# EAGLE design OpenHPI Embedded Smart Home RPi Board2 (EAGLE 7.5.0)
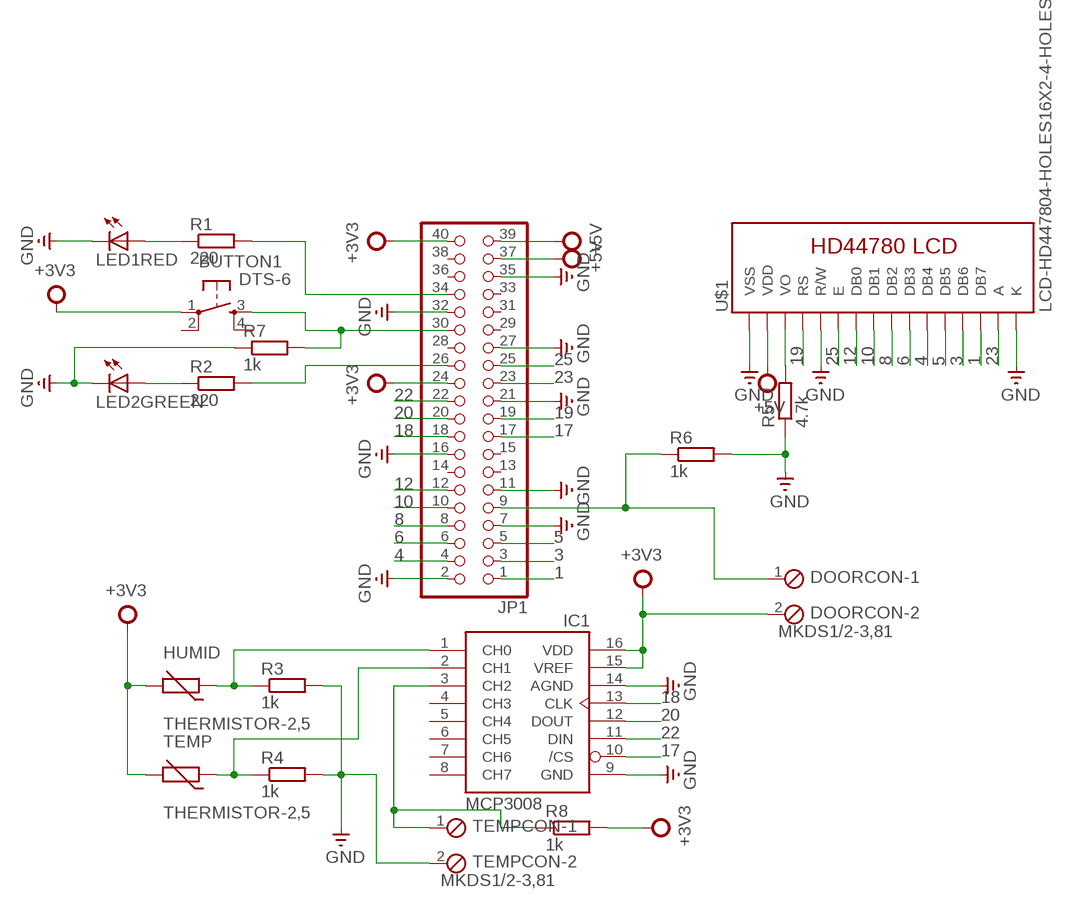
[diagram p0: schematic, sheet 1]

## Parts
BUTTON1  DTS-6  [DTS-6]
DOORCON  MKDS1/2-3,81  [2POL381]
HUMID  THERMISTOR-2,5  [RS-2,5]
IC1  MCP3008  [DIL16]
JP1  PINHD-2X20  [2X20]
LED1RED  LED5MM  [LED5MM]
LED2GREEN  LED5MM  [LED5MM]
R1  220  R-EU_0207/7  [0207/7]
R2  220  R-EU_0207/7  [0207/7]
R3  1k  R-EU_0207/7  [0207/7]
R4  1k  R-EU_0207/7  [0207/7]
R5  4.7k  R-EU_0207/7  [0207/7]
R6  1k  R-EU_0207/7  [0207/7]
R7  1k  R-EU_0207/7  [0207/7]
R8  1k  R-EU_0207/7  [0207/7]
TEMP  THERMISTOR-2,5  [RS-2,5]
TEMPCON  MKDS1/2-3,81  [2POL381]
U$1  LCD-HD447804-HOLES16X2-4-HOLES  [LCD-16X2-4HOLES]

## Nets
1: JP1.1 U$1.14(DB7)
3: JP1.3 U$1.13(DB6)
4: JP1.4 U$1.11(DB4)
5: JP1.5 U$1.12(DB5)
6: JP1.6 U$1.10(DB3)
8: JP1.8 U$1.9(DB2)
10: JP1.10 U$1.8(DB1)
12: JP1.12 U$1.7(DB0)
17: IC1.10(/CS) JP1.17
18: IC1.13(CLK) JP1.18
19: JP1.19 U$1.4(RS)
20: IC1.12(DOUT) JP1.20
22: IC1.11(DIN) JP1.22
23 [pwr]: JP1.23 U$1.15(A)
25: JP1.25 U$1.6(E)
+3V3 [pwr]: BUTTON1.1 DOORCON.2 HUMID.2 IC1.15(VREF) IC1.16(VDD) JP1.24 JP1.40 R8.2 TEMP.2
+5V [pwr]: JP1.37 JP1.39 U$1.2(VDD)
GND [pwr]: IC1.9(GND) IC1.14(AGND) JP1.2 JP1.7 JP1.11 JP1.16 JP1.21 JP1.27 JP1.32 JP1.35 LED1RED.K(C) LED2GREEN.K(C) R3.2 R4.2 R5.1 R6.2 R7.1 TEMPCON.2 U$1.1(VSS) U$1.5(R/W) U$1.16(K)
N$1: LED1RED.A R1.1
N$2: LED2GREEN.A R2.1
N$3: R5.2 U$1.3(VO)
N$4: BUTTON1.3 JP1.30 R7.2
N$5: JP1.34 R1.2
N$6: JP1.26 R2.2
N$9: HUMID.1 IC1.1(CH0) R3.1
N$10: IC1.2(CH1) R4.1 TEMP.1
N$11: IC1.3(CH2) R8.1 TEMPCON.1
N$17: DOORCON.1 JP1.9 R6.1
Unconnected: BUTTON1.2 BUTTON1.4 IC1.4(CH3) IC1.5(CH4) IC1.6(CH5) IC1.7(CH6) IC1.8(CH7) JP1.13 JP1.14 JP1.15 JP1.28 JP1.29 JP1.31 JP1.33 JP1.36 JP1.38

## Library data of the parts
BUTTON1 = switch-tact:DTS-6
DOORCON TEMPCON = con-phoenix-381:MKDS1/2-3,81: MKDS 1/2-3,81 - Order No. 1727010 (RS-Online - 101-5384) Pitch: 3,81mm Number of terminals: 2 Rated Voltage: 160V Maximum load current/ cross section: 12A/1.5mm2-AWG16 Housing Interlocking: none Color: Green
HUMID TEMP = varistor:THERMISTOR: THERMISTOR
IC1 = adafruit:MCP3008
JP1 = pinhead:PINHD-2X20: PIN HEADER
LED1RED LED2GREEN = led:LED: LED OSRAM: - CHIPLED LG R971, LG N971, LY N971, LG Q971, LY Q971, LO R971, LY R971 LH N974, LH R974 LS Q976, LO Q976, LY Q976 LO Q996 - Hyper CHIPLED LW Q18S LB Q993, LB Q99A, LB R99A - SideLED LS A670, LO A670, LY A670, LG A670, LP A670 LB A673, LV A673, LT A673, LW A673 LH A674 LY A675 LS A676, LA A676, LO A676, LY A676, LW A676 LS A679, LY A679, LG A679 - Hyper Micro SIDELED® LS Y876, LA Y876, LO Y876, LY Y876 LT Y87S - SmartLED LW L88C, LW L88S LB L89C, LB L89S, LG L890 LS L89K, LO L89K, LY L89K LS L896, LA L896, LO L896, LY L896 - TOPLED LS T670, LO T670, LY T670, LG T670, LP T670 LSG T670, LSP T670, LSY T670, LOP T670, LYG T670 LG T671, LOG T671, LSG T671 LB T673, LV T673, LT T673, LW T673 LH T674 LS T676, LA T676, LO T676, LY T676, LB T676, LH T676, LSB T676, LW T676 LB T67C, LV T67C, LT T67C, LS T67K, LO T67K, LY T67K, LW E67C LS E67B, LA E67B, LO E67B, LY E67B, LB E67C, LV E67C, LT E67C LW T67C LS T679, LY T679, LG T679 LS T770, LO T770, LY T770, LG T770, LP T770 LB T773, LV T773, LT T773, LW T773 LH T774 LS E675, LA E675, LY E675, LS T675 LS T776, LA T776, LO T776, LY T776, LB T776 LHGB T686 LT T68C, LB T68C - Hyper Mini TOPLED® LB M676 - Mini TOPLED Santana® LG M470 LS M47K, LO M47K, LY M47K Source: http://www.osram.convergy.de LUXEON: - LUMILED® LXK2-PW12-R00, LXK2-PW12-S00, LXK2-PW14-U00, LXK2-PW14-V00 LXK2-PM12-R00, LXK2-PM12-S00, LXK2-PM14-U00 LXK2-PE12-Q00, LXK2-PE12-R00, LXK2-PE12-S00, LXK2-PE14-T00, LXK2-PE14-U00 LXK2-PB12-K00, LXK2-PB12-L00, LXK2-PB12-M00, LXK2-PB14-N00, LXK2-PB14-P00, LXK2-PB14-Q00 LXK2-PR12-L00, LXK2-PR12-M00, LXK2-PR14-Q00, LXK2-PR14-R00 LXK2-PD12-Q00, LXK2-PD12-R00, LXK2-PD12-S00 LXK2-PH12-R00, LXK2-PH12-S00 LXK2-PL12-P00, LXK2-PL12-Q00, LXK2-PL12-R00 Source: www.luxeon.com KINGBRIGHT: KA-3528ASYC Source: www.kingbright.com
R1-R8 = rcl:R-EU_: RESISTOR, European symbol
U$1 = HD44780LCD:LCD-HD44780

## Net classes
1 pwr: width 0.33 mm

## Board
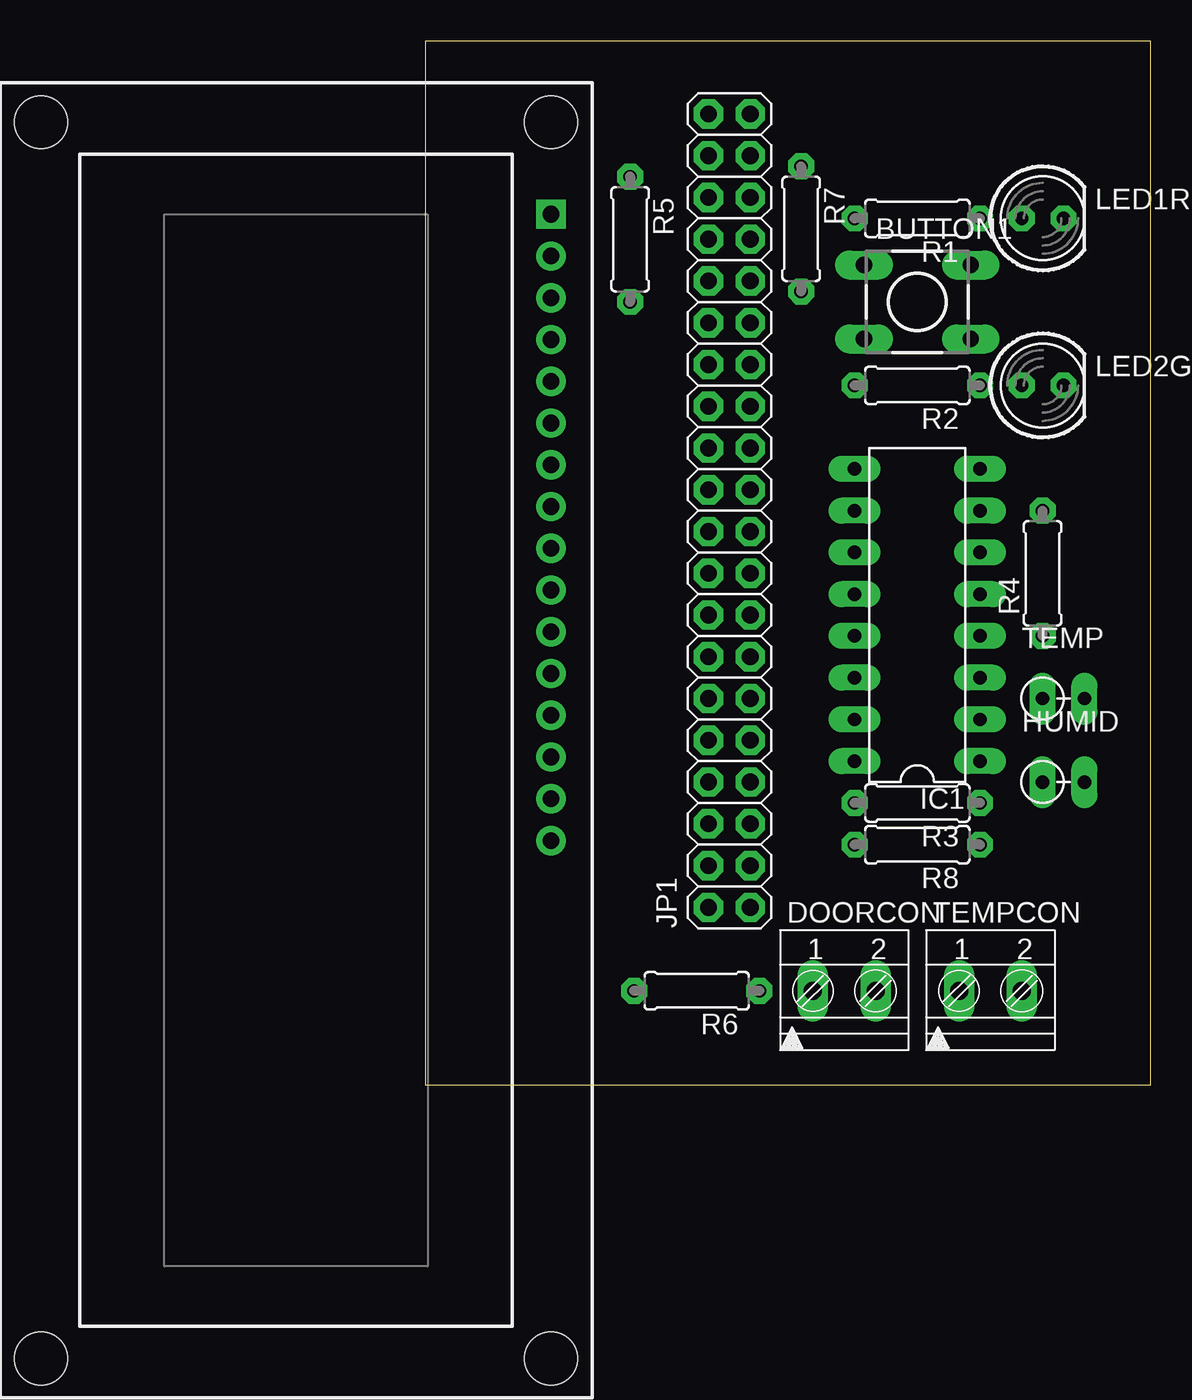
[diagram p1: board, top side]
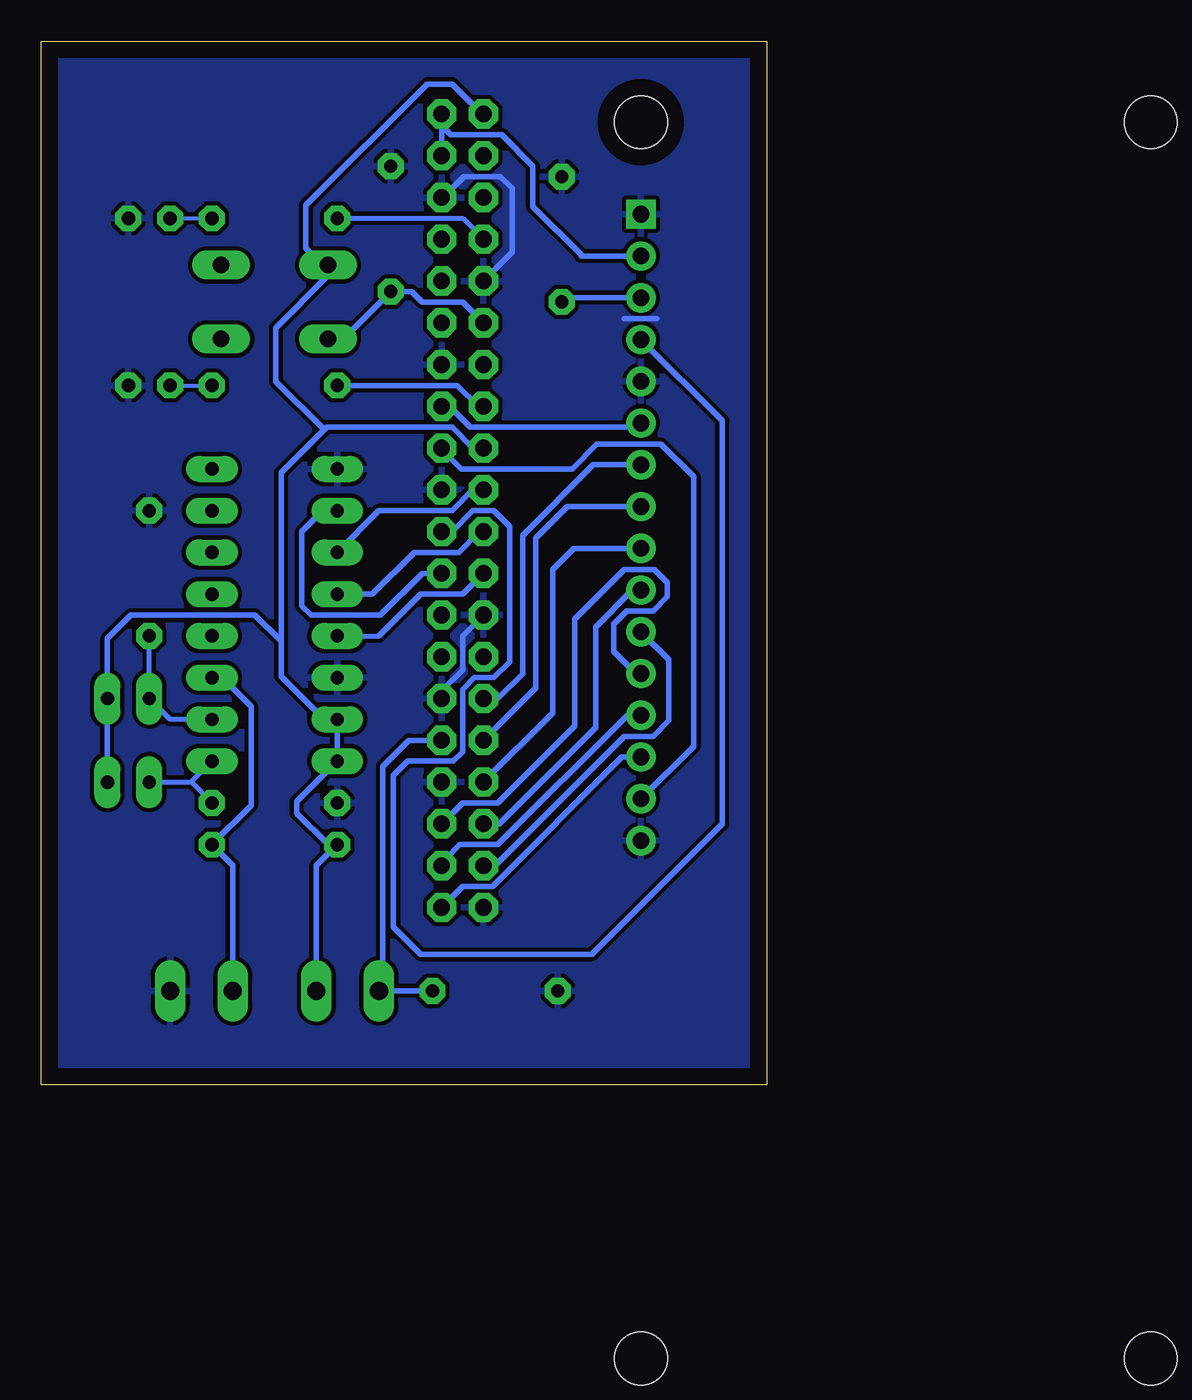
[diagram p2: board, bottom side, seen from below]

Size 44.12 x 63.49 mm. Coordinates in mm from the lower left corner, seen from the top.
Outline: 0,0 44.12,0 44.12,63.49 0,63.49 0,0
Copper layers (1*16): Top 0.035mm / dielectric 1.5mm / Bottom 0.035mm
Design rules "ranger81_de_v3": minimum track width 10mil, minimum drill 0.8mm, track to track 8mil, track to pad 8mil, pad to pad 8mil, via to via 8mil, smd to smd 8mil, copper to edge 40mil, drill to drill 8mil, minimum pad ring 15mil, minimum via ring 15mil, stop-mask expansion 4mil, vias tented up to drill 0mil, thermal gap 10mil

### Footprints (pad centres in the part's own frame; a part is rotated, then mirrored left to right if it is on the bottom)
DTS-6 = drill 1 long: 1 -3.25,2.25; 2 3.25,2.25; 3 -3.25,-2.25; 4 3.25,-2.25
2POL381 = drill 1.1 long: 1 0,0; 2 3.81,0
RS-2,5 = drill 0.813 long: 1 -1.27,0; 2 1.27,0
DIL16 = drill 0.813 long: 1 -8.89,-3.81; 2 -6.35,-3.81; 3 -3.81,-3.81; 4 -1.27,-3.81; 5 1.27,-3.81; 6 3.81,-3.81; 7 6.35,-3.81; 8 8.89,-3.81; 9 8.89,3.81; 10 6.35,3.81; 11 3.81,3.81; 12 1.27,3.81; 13 -1.27,3.81; 14 -3.81,3.81; 15 -6.35,3.81; 16 -8.89,3.81
2X20 = drill 1.016 octagon: 1 -24.13,-1.27; 2 -24.13,1.27; 3 -21.59,-1.27; 4 -21.59,1.27; 5 -19.05,-1.27; 6 -19.05,1.27; 7 -16.51,-1.27; 8 -16.51,1.27; 9 -13.97,-1.27; 10 -13.97,1.27; 11 -11.43,-1.27; 12 -11.43,1.27; 13 -8.89,-1.27; 14 -8.89,1.27; 15 -6.35,-1.27; 16 -6.35,1.27; 17 -3.81,-1.27; 18 -3.81,1.27; 19 -1.27,-1.27; 20 -1.27,1.27; 21 1.27,-1.27; 22 1.27,1.27; 23 3.81,-1.27; 24 3.81,1.27; 25 6.35,-1.27; 26 6.35,1.27; 27 8.89,-1.27; 28 8.89,1.27; 29 11.43,-1.27; 30 11.43,1.27; 31 13.97,-1.27; 32 13.97,1.27; 33 16.51,-1.27; 34 16.51,1.27; 35 19.05,-1.27; 36 19.05,1.27; 37 21.59,-1.27; 38 21.59,1.27; 39 24.13,-1.27; 40 24.13,1.27
LED5MM = drill 0.813 octagon: A -1.27,0; K 1.27,0
0207/7 = drill 0.813 octagon: 1 -3.81,0; 2 3.81,0
LCD-16X2-4HOLES = drill 1.016 square: 1 -32,15.5 | drill 1.016: 2 -29.46,15.5; 3 -26.92,15.5; 4 -24.38,15.5; 5 -21.84,15.5; 6 -19.3,15.5; 7 -16.76,15.5; 8 -14.22,15.5; 9 -11.68,15.5; 10 -9.14,15.5; 11 -6.6,15.5; 12 -4.06,15.5; 13 -1.52,15.5; 14 1.02,15.5; 15 3.56,15.5; 16 6.1,15.5 | hole 3.2: -37.6,15.5; -37.6,-15.5; 37.6,-15.5; 37.6,15.5

### Placement (x,y rotation side)
BUTTON1  29.92,47.62 0 top
DOORCON  23.57,5.71 0 top
HUMID  38.81,18.41 0 top
IC1  29.92,28.57 90 top
JP1  18.49,34.92 90 top
LED1RED  37.54,52.7 0 top
LED2GREEN  37.54,42.55 0 top
R1  29.92,52.7 180 top
R2  29.92,42.55 180 top
R3  29.92,17.14 180 top
R4  37.54,31.11 90 top
R5  12.46,51.44 270 top
R6  16.51,5.71 180 top
R7  22.86,52.07 270 top
R8  29.92,14.61 180 top
TEMP  38.81,23.5 0 top
TEMPCON  32.46,5.71 0 top
U$1  -7.86,20.95 270 top

### Tracks (layer width: path | path; a pad name or v marks a point on that pad's centre or on a via)
1
  Bottom 0.33: JP1.1 18.49,12.06 16.67,12.06 8.8,19.93 U$1.14
3
  Bottom 0.33: U$1.13 8.48,22.48 16.35,14.61 18.65,14.61 19.45,13.81 19.45,13.65 JP1.3
4
  Bottom 0.33: JP1.4 16.51,13.34 8.65,21.19 6.91,21.19 5.95,22.15 5.95,25.87 U$1.11
5
  Bottom 0.33: U$1.12 7.95,25.02 9.29,26.35 9.29,28.02 8.49,28.81 6.91,28.81 6.03,29.69 6.03,30.56 6.83,31.35 8.65,31.35 11.67,28.34 11.67,21.83 16.35,17.14 18.49,17.14 JP1.5
6
  Bottom 0.33: U$1.10 8.16,30.09 10.4,27.86 10.4,21.75 16.27,15.88 JP1.6
8
  Bottom 0.33: U$1.9 11.74,32.63 13.02,31.35 13.02,22.62 JP1.8
10
  Bottom 0.33: U$1.8 12.13,35.17 14.05,33.26 14.05,24.13 JP1.10
12
  Bottom 0.33: U$1.7 10.54,37.72 14.84,33.42 14.84,25 16.35,23.5 JP1.12
17
  Bottom 0.33: JP1.17 20.95,31.11 23.5,28.57 27.7,28.57 28.26,29.13 28.26,33.66 26.99,34.92 IC1.10
18
  Bottom 0.305: IC1.13 23.57,27.3
  Bottom 0.33: 23.57,27.3 21.03,29.84 18.49,29.84 JP1.18
19
  Bottom 0.33: JP1.19 19.13,33.66 17.86,34.92 16.59,34.92 15.64,33.97 15.64,25.72 16.59,24.77 17.78,24.77 18.49,24.05 18.49,20.24 19.05,19.68 21.83,19.68 22.7,18.81 22.7,9.6 21.03,7.94 10.64,7.94 2.7,15.88 2.7,40.39 U$1.4
20
  Bottom 0.33: JP1.20 17.46,33.66 18.73,32.38 21.43,32.38 23.97,29.84 IC1.12
22
  Bottom 0.33: JP1.22 17.86,36.2 19.13,34.92 23.57,34.92 IC1.11
23
  Bottom 0.33: JP1.23 19.76,38.66 18.57,37.47 11.83,37.47 10.32,38.97 6.43,38.97 4.45,36.99 4.45,20.59 U$1.15
25
  Bottom 0.33: JP1.25 19.29,41.27 18.02,40.01 7.89,40.01 U$1.6
+3V3
  Bottom 0.33: DOORCON.2 27.38,13.34 R8.2 26.67,14.61 28.57,16.51 28.57,17.22 IC1.16 IC1.15 26.91,22.23 29.53,24.84 29.53,26.99 | 29.53,26.99 29.53,37.23 26.91,39.85 | JP1.24 17.86,38.73 19.13,40.01 26.75,40.01 26.91,39.85 | HUMID.2 TEMP.2 40.08,27.15 38.66,28.57 31.11,28.57 29.53,26.99 | JP1.40 17.3,59.05 19.13,60.88 20.64,60.88 28.02,53.5 28.02,50.9 26.99,49.88 BUTTON1.1 26.67,49.21 29.84,46.04 29.84,42.78 26.91,39.85
+5V
  Bottom 0.33: U$1.2 11.28,50.41 11.28,50.49 14.21,53.42 14.21,55.88 16.11,57.78 19.21,57.78 19.76,58.34 | JP1.39 19.76,58.34 | 19.76,58.34 JP1.37
GND
  Bottom 0.33: JP1.16 18.49,27.3 18.49,25.24 19.76,23.97 JP1.11 | 6.67,46.59 8.65,46.59 | 19.82,53.92 19.74,53.92 18.41,55.24 16.19,55.24 15.48,54.53 15.48,50.64 JP1.32
  Bottom 0.406: 19.93,53.98 19.82,53.98 | 19.82,53.98 19.82,53.92 | 19.82,53.98 JP1.35
  pour Bottom (isolate 0.254): 0,80.01 100.33,80.01 100.33,0 0,0
N$1
  Bottom 0.254: R1.1 33.76,52.72 36.27,52.72 LED1RED.A
N$2
  Bottom 0.254: LED2GREEN.A R2.1
N$3
  Bottom 0.33: U$1.3 12.21,47.88 R5.2
N$4
  Bottom 0.33: BUTTON1.3 25.75,45.38 R7.2 21.59,48.26 20.95,47.62 18.49,47.62 JP1.30
N$5
  Bottom 0.305: R1.2 18.49,52.7 JP1.34
N$6
  Bottom 0.33: JP1.26 17.54,41.27 18.81,42.55 R2.2
N$9
  Bottom 0.305: HUMID.1 35,18.41 | 35,18.41 R3.1 | 35,18.41 IC1.1
N$10
  Bottom 0.305: IC1.2 36.27,22.23 TEMP.1 R4.1
N$11
  Bottom 0.33: TEMPCON.1 32.46,13.34 R8.1 31.35,16.99 31.35,23.02 33.1,24.77 IC1.3
N$17
  Bottom 0.33: JP1.9 21.75,20.95 23.34,19.37 23.34,5.95 DOORCON.1 R6.1